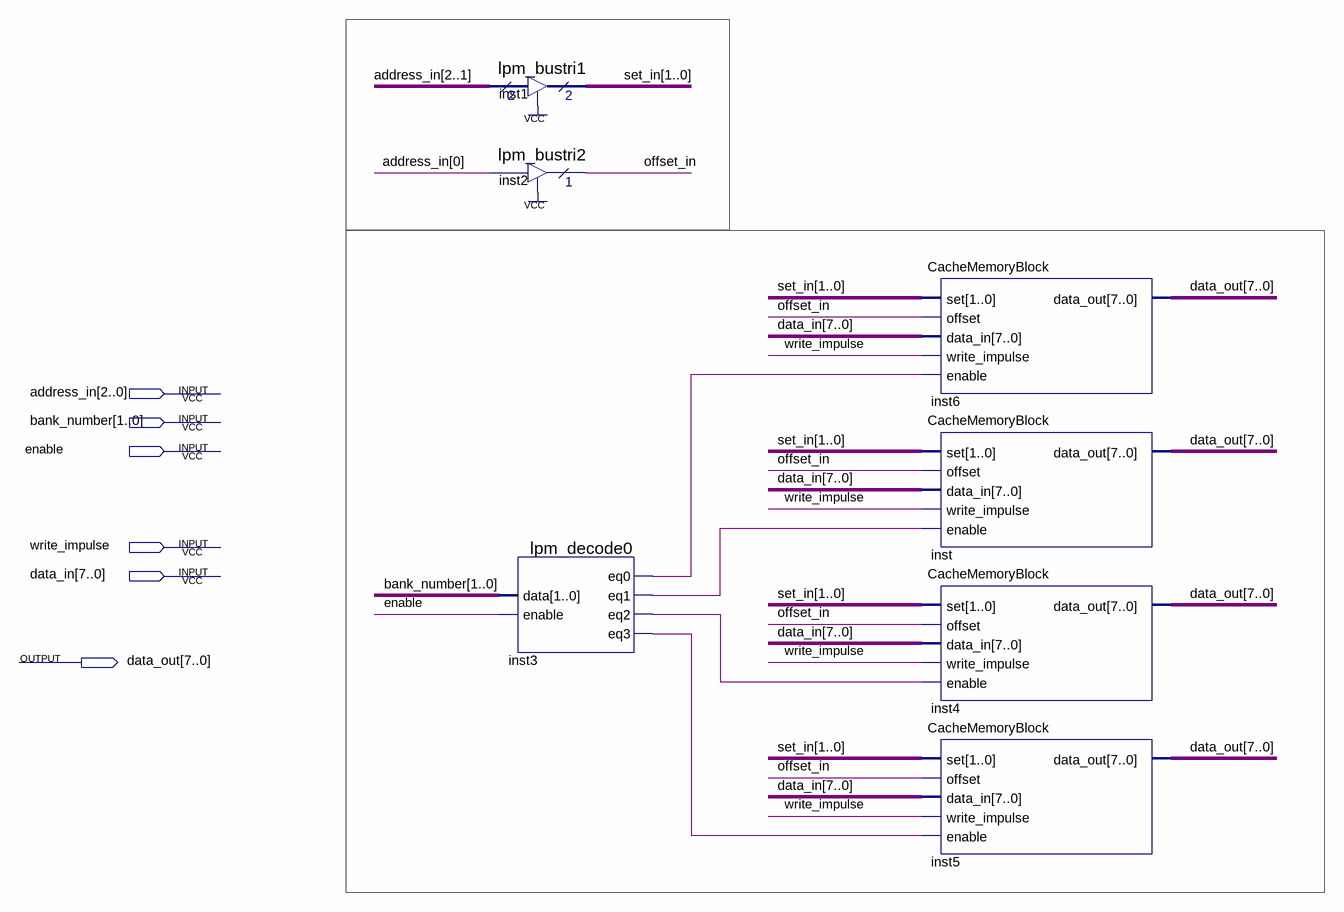
[diagram p0: schematic sheet]
// Quartus schematic CacheMemory.bdf as structural Verilog: 7 symbols, 6 pins
module CacheMemory (
  input  [2:0] address_in,
  input  [1:0] bank_number,
  input  enable,
  input  write_impulse,
  input  [7:0] data_in,
  output [7:0] data_out
);

  wire inst3_eq0, inst3_eq1, inst3_eq2, inst3_eq3, offset_in;
  wire [1:0] set_in;

  lpm_bustri1 inst1 (.enabledt(1'b1), .data(address_in[2:1]), .tridata(set_in));
  lpm_bustri2 inst2 (.enabledt(1'b1), .data(address_in[0]), .tridata(offset_in));
  lpm_decode0 inst3 (
    .data(bank_number), .enable(enable), .eq0(inst3_eq0), .eq1(inst3_eq1), .eq2(inst3_eq2), .eq3(inst3_eq3));
  CacheMemoryBlock inst6 (
    .set(set_in), .offset(offset_in), .data_in(data_in), .write_impulse(write_impulse), .enable(inst3_eq0),
    .data_out(data_out));
  CacheMemoryBlock inst (
    .set(set_in), .offset(offset_in), .data_in(data_in), .write_impulse(write_impulse), .enable(inst3_eq1),
    .data_out(data_out));
  CacheMemoryBlock inst4 (
    .set(set_in), .offset(offset_in), .data_in(data_in), .write_impulse(write_impulse), .enable(inst3_eq2),
    .data_out(data_out));
  CacheMemoryBlock inst5 (
    .set(set_in), .offset(offset_in), .data_in(data_in), .write_impulse(write_impulse), .enable(inst3_eq3),
    .data_out(data_out));
endmodule
